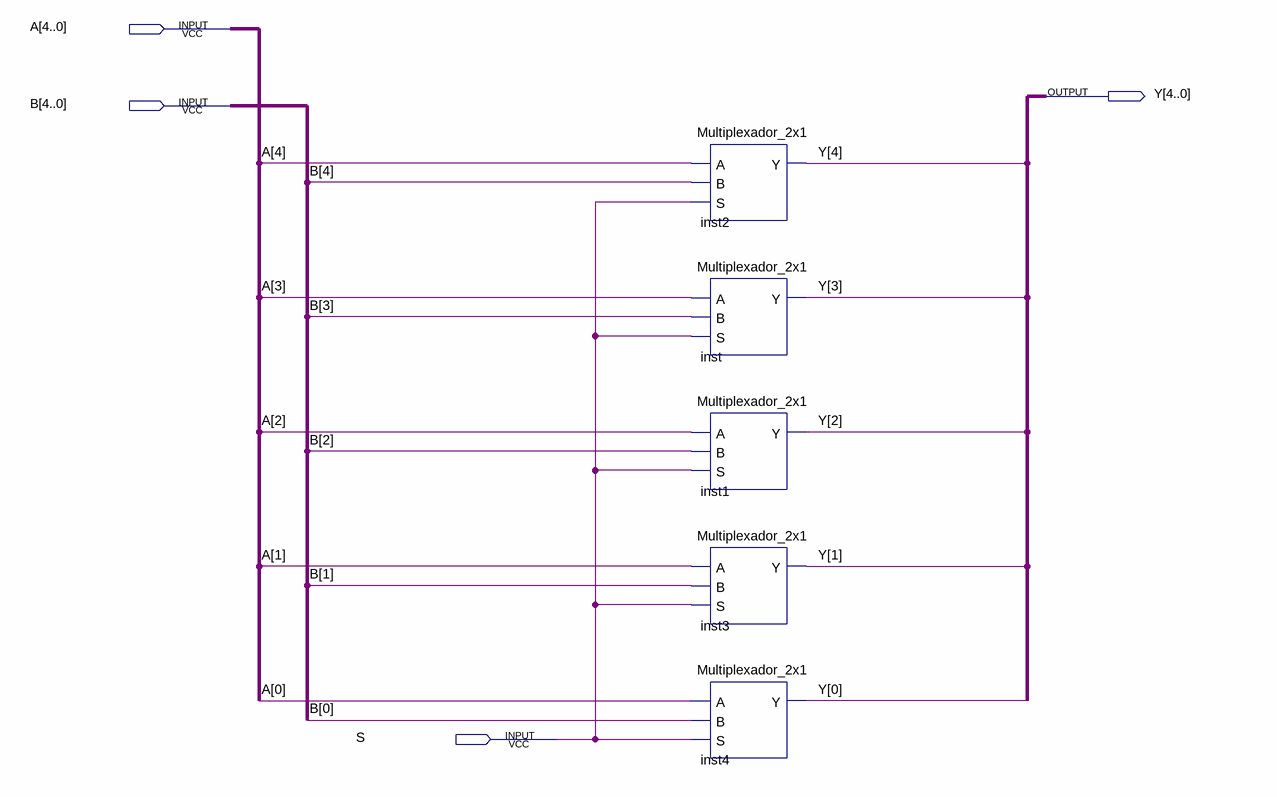
[diagram p0: schematic sheet]
// Quartus schematic BusMux_2x1.bdf as structural Verilog: 5 symbols, 4 pins
module BusMux_2x1 (
  input  [4:0] A,
  input  [4:0] B,
  input  S,
  output [4:0] Y
);

  Multiplexador_2x1 inst2 (.A(A[4]), .B(B[4]), .S(S), .Y(Y[4]));
  Multiplexador_2x1 inst (.A(A[3]), .B(B[3]), .S(S), .Y(Y[3]));
  Multiplexador_2x1 inst1 (.A(A[2]), .B(B[2]), .S(S), .Y(Y[2]));
  Multiplexador_2x1 inst3 (.A(A[1]), .B(B[1]), .S(S), .Y(Y[1]));
  Multiplexador_2x1 inst4 (.A(A[0]), .B(B[0]), .S(S), .Y(Y[0]));
endmodule
